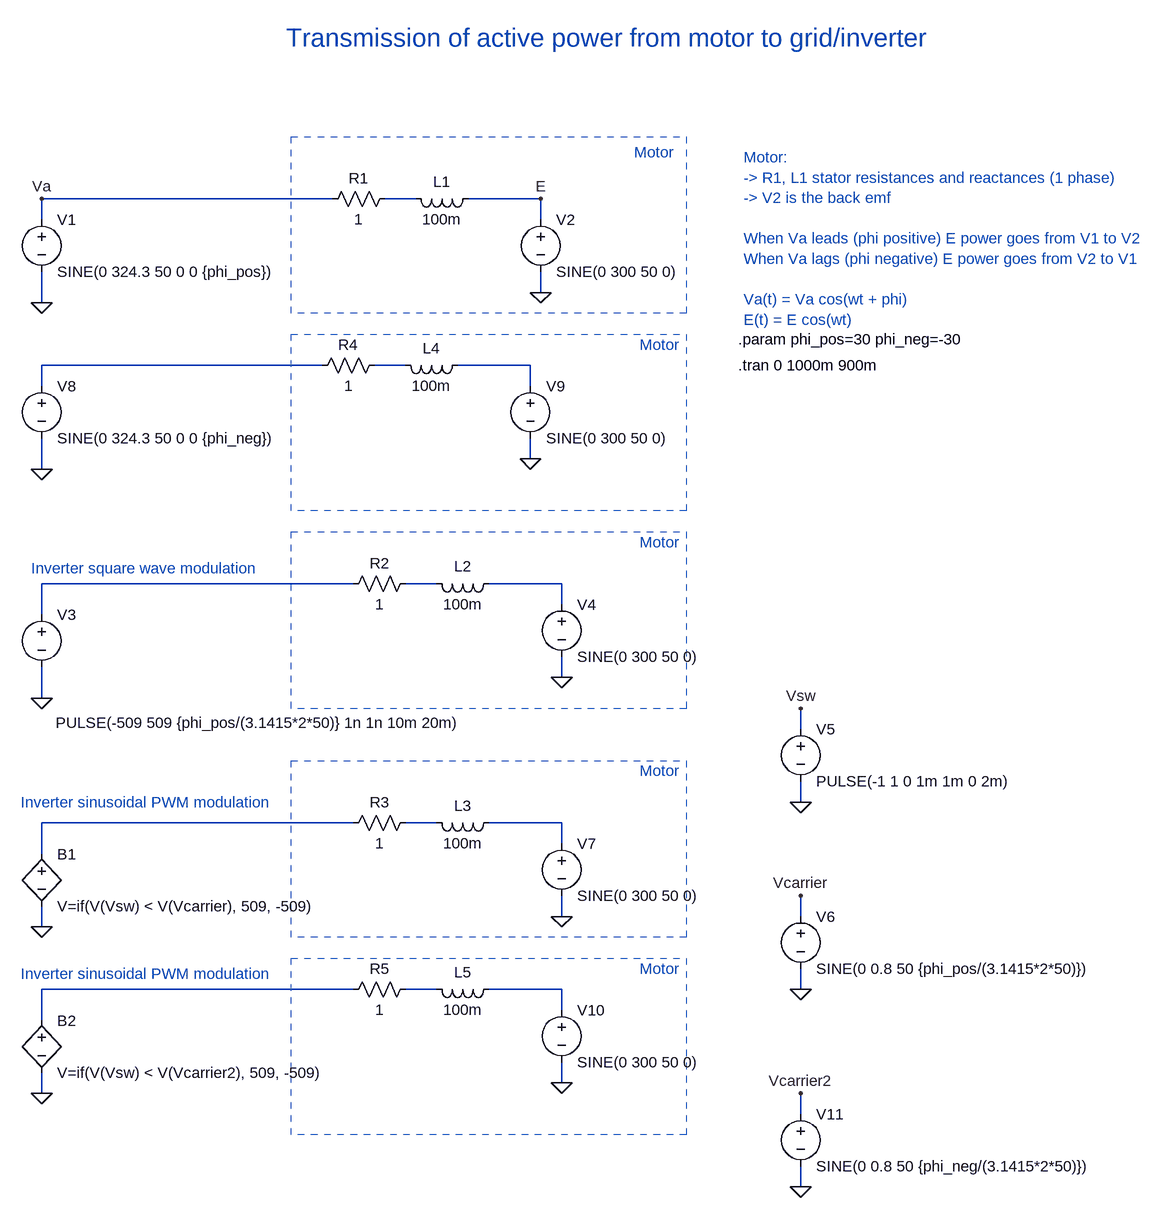
[diagram p0: schematic Power-line-power-transmission.asc]
Power-line-power-transmission.asc, the LTspice schematic file:
Version 4
SHEET 1 1524 1620
WIRE -16 -208 -464 -208
WIRE 112 -208 64 -208
WIRE 304 -208 192 -208
WIRE -464 -176 -464 -208
WIRE 304 -176 304 -208
WIRE 304 -64 304 -96
WIRE -464 -48 -464 -96
WIRE -32 48 -464 48
WIRE 96 48 48 48
WIRE 288 48 176 48
WIRE -464 80 -464 48
WIRE 288 80 288 48
WIRE 288 192 288 160
WIRE -464 208 -464 160
WIRE 16 384 -464 384
WIRE 144 384 96 384
WIRE 336 384 224 384
WIRE 336 416 336 384
WIRE -464 432 -464 384
WIRE 336 528 336 496
WIRE -464 560 -464 512
WIRE 704 608 704 576
WIRE 704 720 704 688
WIRE 16 752 -464 752
WIRE 144 752 96 752
WIRE 336 752 224 752
WIRE 336 784 336 752
WIRE -464 800 -464 752
WIRE 336 896 336 864
WIRE 704 896 704 864
WIRE -464 912 -464 880
WIRE 16 1008 -464 1008
WIRE 144 1008 96 1008
WIRE 336 1008 224 1008
WIRE 704 1008 704 976
WIRE 336 1040 336 1008
WIRE -464 1056 -464 1008
WIRE 336 1152 336 1120
WIRE -464 1168 -464 1136
WIRE 704 1200 704 1168
WIRE 704 1312 704 1280
FLAG 304 -64 0
FLAG -464 -48 0
FLAG 304 -208 E
FLAG -464 -208 Va
FLAG 336 528 0
FLAG -464 560 0
FLAG 704 720 0
FLAG 704 1008 0
FLAG -464 912 0
FLAG 704 864 Vcarrier
FLAG 704 576 Vsw
FLAG 336 896 0
FLAG 288 192 0
FLAG -464 208 0
FLAG -464 1168 0
FLAG 336 1152 0
FLAG 704 1312 0
FLAG 704 1168 Vcarrier2
SYMBOL voltage -464 -192 R0
WINDOW 123 0 0 Left 0
WINDOW 39 0 0 Left 0
SYMATTR InstName V1
SYMATTR Value SINE(0 324.3 50 0 0 {phi_pos})
SYMBOL ind 208 -224 R90
WINDOW 0 5 56 VBottom 2
WINDOW 3 32 56 VTop 2
SYMATTR InstName L1
SYMATTR Value 100m
SYMBOL voltage 304 -192 R0
WINDOW 123 0 0 Left 0
WINDOW 39 0 0 Left 0
SYMATTR InstName V2
SYMATTR Value SINE(0 300 50 0)
SYMBOL res 80 -224 R90
WINDOW 0 0 56 VBottom 2
WINDOW 3 32 56 VTop 2
SYMATTR InstName R1
SYMATTR Value 1
SYMBOL voltage -464 416 R0
WINDOW 3 22 182 Left 2
WINDOW 123 0 0 Left 0
WINDOW 39 0 0 Left 0
SYMATTR Value PULSE(-509 509 {phi_pos/(3.1415*2*50)} 1n 1n 10m 20m)
SYMATTR InstName V3
SYMBOL ind 240 368 R90
WINDOW 0 5 56 VBottom 2
WINDOW 3 32 56 VTop 2
SYMATTR InstName L2
SYMATTR Value 100m
SYMBOL voltage 336 400 R0
WINDOW 123 0 0 Left 0
WINDOW 39 0 0 Left 0
SYMATTR InstName V4
SYMATTR Value SINE(0 300 50 0)
SYMBOL res 112 368 R90
WINDOW 0 0 56 VBottom 2
WINDOW 3 32 56 VTop 2
SYMATTR InstName R2
SYMATTR Value 1
SYMBOL voltage 704 592 R0
WINDOW 123 0 0 Left 0
WINDOW 39 0 0 Left 0
SYMATTR InstName V5
SYMATTR Value PULSE(-1 1 0 1m 1m 0 2m)
SYMBOL voltage 704 880 R0
WINDOW 123 0 0 Left 0
WINDOW 39 0 0 Left 0
SYMATTR InstName V6
SYMATTR Value SINE(0 0.8 50 {phi_pos/(3.1415*2*50)})
SYMBOL bv -464 784 R0
SYMATTR InstName B1
SYMATTR Value V=if(V(Vsw) < V(Vcarrier), 509, -509)
SYMBOL ind 240 736 R90
WINDOW 0 5 56 VBottom 2
WINDOW 3 32 56 VTop 2
SYMATTR InstName L3
SYMATTR Value 100m
SYMBOL voltage 336 768 R0
WINDOW 123 0 0 Left 0
WINDOW 39 0 0 Left 0
SYMATTR InstName V7
SYMATTR Value SINE(0 300 50 0)
SYMBOL res 112 736 R90
WINDOW 0 0 56 VBottom 2
WINDOW 3 32 56 VTop 2
SYMATTR InstName R3
SYMATTR Value 1
SYMBOL voltage -464 64 R0
WINDOW 123 0 0 Left 0
WINDOW 39 0 0 Left 0
SYMATTR InstName V8
SYMATTR Value SINE(0 324.3 50 0 0 {phi_neg})
SYMBOL ind 192 32 R90
WINDOW 0 5 56 VBottom 2
WINDOW 3 32 56 VTop 2
SYMATTR InstName L4
SYMATTR Value 100m
SYMBOL voltage 288 64 R0
WINDOW 123 0 0 Left 0
WINDOW 39 0 0 Left 0
SYMATTR InstName V9
SYMATTR Value SINE(0 300 50 0)
SYMBOL res 64 32 R90
WINDOW 0 0 56 VBottom 2
WINDOW 3 32 56 VTop 2
SYMATTR InstName R4
SYMATTR Value 1
SYMBOL bv -464 1040 R0
SYMATTR InstName B2
SYMATTR Value V=if(V(Vsw) < V(Vcarrier2), 509, -509)
SYMBOL ind 240 992 R90
WINDOW 0 5 56 VBottom 2
WINDOW 3 32 56 VTop 2
SYMATTR InstName L5
SYMATTR Value 100m
SYMBOL voltage 336 1024 R0
WINDOW 123 0 0 Left 0
WINDOW 39 0 0 Left 0
SYMATTR InstName V10
SYMATTR Value SINE(0 300 50 0)
SYMBOL res 112 992 R90
WINDOW 0 0 56 VBottom 2
WINDOW 3 32 56 VTop 2
SYMATTR InstName R5
SYMATTR Value 1
SYMBOL voltage 704 1184 R0
WINDOW 123 0 0 Left 0
WINDOW 39 0 0 Left 0
SYMATTR InstName V11
SYMATTR Value SINE(0 0.8 50 {phi_neg/(3.1415*2*50)})
TEXT 608 48 Left 2 !.tran 0 1000m 900m
TEXT 608 8 Left 2 !.param phi_pos=30 phi_neg=-30
TEXT -480 360 Left 2 ;Inverter square wave modulation
TEXT -88 -456 Left 4 ;Transmission of active power from motor to grid/inverter
TEXT 616 -272 Left 2 ;Motor: \n-> R1, L1 stator resistances and reactances (1 phase)\n-> V2 is the back emf\n \nWhen Va leads (phi positive) E power goes from V1 to V2\nWhen Va lags (phi negative) E power goes from V2 to V1\n \nVa(t) = Va cos(wt + phi)\nE(t) = E cos(wt)
TEXT 448 -280 Left 2 ;Motor
TEXT 456 16 Left 2 ;Motor
TEXT 456 320 Left 2 ;Motor
TEXT 456 672 Left 2 ;Motor
TEXT 456 976 Left 2 ;Motor
TEXT -496 720 Left 2 ;Inverter sinusoidal PWM modulation
TEXT -496 984 Left 2 ;Inverter sinusoidal PWM modulation
RECTANGLE Normal 528 -32 -80 -304 2
RECTANGLE Normal 528 272 -80 0 2
RECTANGLE Normal 528 576 -80 304 2
RECTANGLE Normal 528 928 -80 656 2
RECTANGLE Normal 528 1232 -80 960 2

The netlist it stands for:
* Power-line-power-transmission.asc
V1 Va 0 SINE(0 324.3 50 0 0 {phi_pos})
L1 E N001 100m
V2 E 0 SINE(0 300 50 0)
R1 N001 Va 1
V3 N005 0 PULSE(-509 509 {phi_pos/(3.1415*2*50)} 1n 1n 10m 20m)
L2 N007 N006 100m
V4 N007 0 SINE(0 300 50 0)
R2 N006 N005 1
V5 Vsw 0 PULSE(-1 1 0 1m 1m 0 2m)
V6 Vcarrier 0 SINE(0 0.8 50 {phi_pos/(3.1415*2*50)})
B1 N008 0 V=if(V(Vsw) < V(Vcarrier), 509, -509)
L3 N010 N009 100m
V7 N010 0 SINE(0 300 50 0)
R3 N009 N008 1
V8 N002 0 SINE(0 324.3 50 0 0 {phi_neg})
L4 N004 N003 100m
V9 N004 0 SINE(0 300 50 0)
R4 N003 N002 1
B2 N011 0 V=if(V(Vsw) < V(Vcarrier2), 509, -509)
L5 N013 N012 100m
V10 N013 0 SINE(0 300 50 0)
R5 N012 N011 1
V11 Vcarrier2 0 SINE(0 0.8 50 {phi_neg/(3.1415*2*50)})
.tran 0 1000m 900m
.param phi_pos=30 phi_neg=-30
* Inverter square wave modulation
* Transmission of active power from motor to grid/inverter
* Motor:
* -> R1, L1 stator resistances and reactances (1 phase)
* -> V2 is the back emf
* When Va leads (phi positive) E power goes from V1 to V2
* When Va lags (phi negative) E power goes from V2 to V1
* Va(t) = Va cos(wt + phi)
* E(t) = E cos(wt)
* Motor
* Motor
* Motor
* Motor
* Motor
* Inverter sinusoidal PWM modulation
* Inverter sinusoidal PWM modulation
.backanno
.end